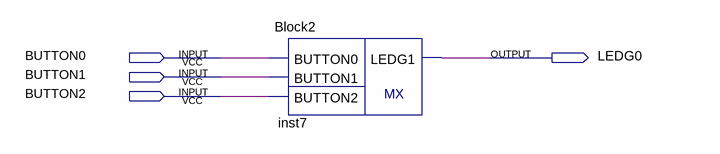
[diagram p0: schematic sheet]
// Quartus schematic lab3.bdf as structural Verilog: 1 symbols, 4 pins
module lab3 (
  input  BUTTON0,
  input  BUTTON1,
  input  BUTTON2,
  output LEDG0
);

  Block2 inst7 (.BUTTON0(BUTTON0), .BUTTON1(BUTTON1), .BUTTON2(BUTTON2), .LEDG1(LEDG0));
endmodule
